# EAGLE design HUD_Display (EAGLE 7.3.0)
CNAME: 7-Segment display; CREVISION: 1; DESIGNER: Mosab Wadea
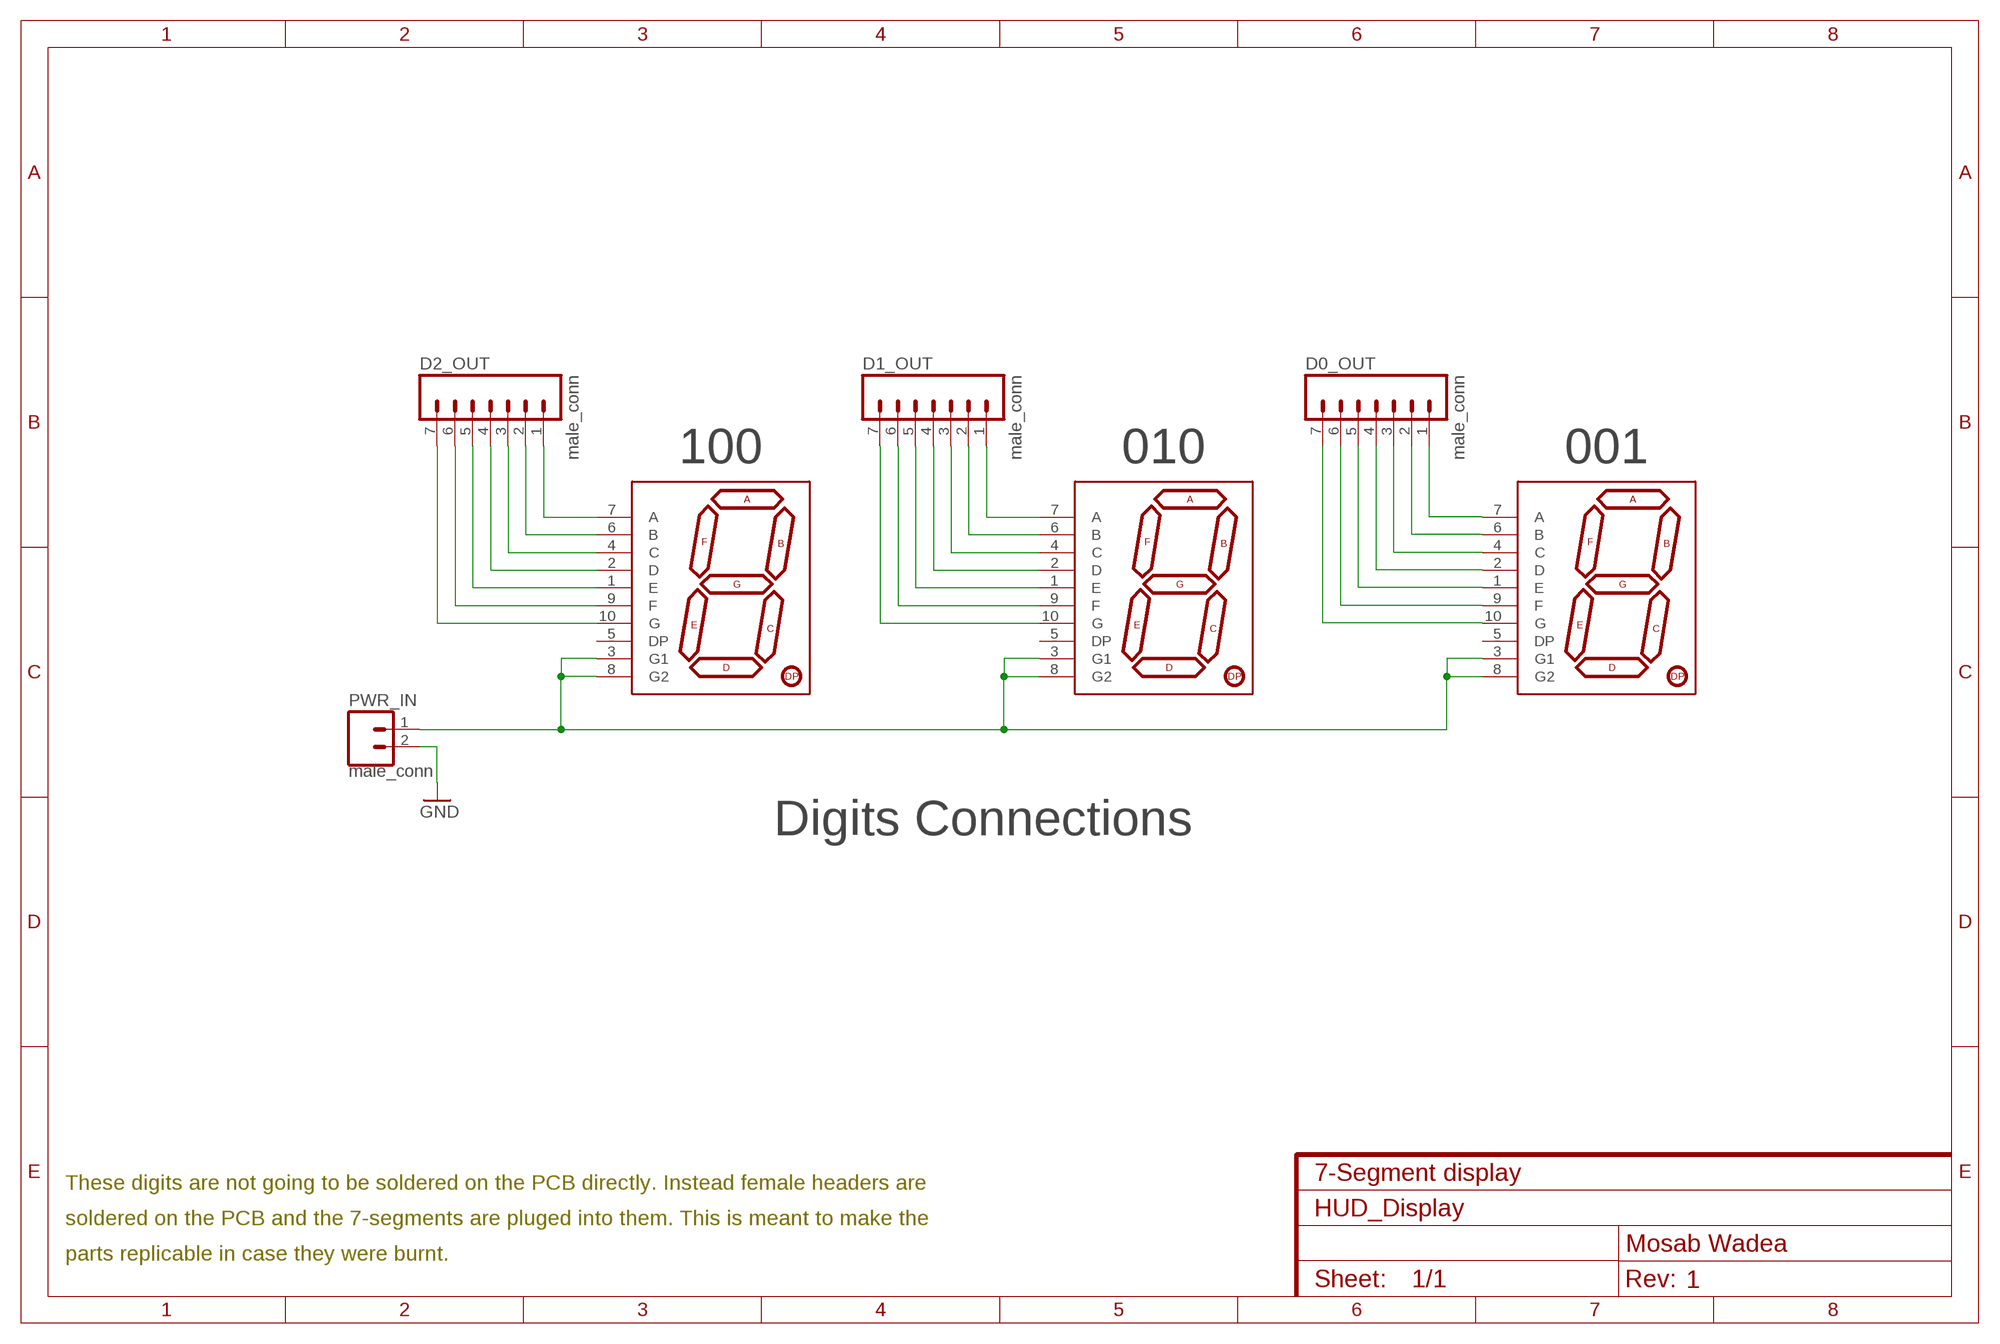
[diagram p0: schematic, sheet 1]

## Parts
D0  7-SEGMENT-DISPLAY-1"-REDEZ  [7-SEGMENT-1"PTH-EZ]
D0_OUT  male_conn  M07  [1X07]
D1  7-SEGMENT-DISPLAY-1"-REDEZ  [7-SEGMENT-1"PTH-EZ]
D1_OUT  male_conn  M07  [1X07]
D2  7-SEGMENT-DISPLAY-1"-REDEZ  [7-SEGMENT-1"PTH-EZ]
D2_OUT  male_conn  M07  [1X07]
PWR_IN  male_conn  M02PTH  [1X02]

## Nets
D1_OUT: D1.9(F) D1_OUT.6
DO_OUT: D2.10(G) D2_OUT.7
GND: PWR_IN.2
N$1: D2.7(A) D2_OUT.1
N$2: D2.6(B) D2_OUT.2
N$3: D2.4(C) D2_OUT.3
N$4: D2.2(D) D2_OUT.4
N$5: D2.1(E) D2_OUT.5
N$6: D2.9(F) D2_OUT.6
N$8: D1.7(A) D1_OUT.1
N$9: D1.6(B) D1_OUT.2
N$10: D1.4(C) D1_OUT.3
N$11: D1.2(D) D1_OUT.4
N$12: D1.1(E) D1_OUT.5
N$14: D1.10(G) D1_OUT.7
N$15: D0.7(A) D0_OUT.1
N$16: D0.6(B) D0_OUT.2
N$17: D0.4(C) D0_OUT.3
N$18: D0.2(D) D0_OUT.4
N$19: D0.1(E) D0_OUT.5
N$20: D0.9(F) D0_OUT.6
N$21: D0.10(G) D0_OUT.7
VCC: D0.3(G1) D0.8(G2) D1.3(G1) D1.8(G2) D2.3(G1) D2.8(G2) PWR_IN.1
Unconnected: D0.5(DP) D1.5(DP) D2.5(DP)

## Notes on the sheet
- 100 | 010 | 001
- Digits Connections
- These digits are not going to be soldered on the PCB directly. Instead female headers are
- soldered on the PCB and the 7-segments are pluged into them. This is meant to make the
- parts replicable in case they were burnt.

## Library data of the parts
D0 D1 D2 = SparkFun-Displays:7-SEGMENT-DISPLAY-1"-RED: 7-Segment Display 1" Red (COM-08546) EZ is for kits. Pads are only exposed on the bottom side to help prevent soldering in upside down.
D0_OUT D1_OUT D2_OUT = SparkFun-Connectors:M07: Header 7 Standard 7-pin 0.1" header. Use with straight break away headers (SKU : PRT-00116), right angle break away headers (PRT-00553), swiss pins (PRT-00743), machine pins (PRT-00117), and female headers (PRT-00115). NOTES ON THE VARIANTS LOCK and LOCK_LONGPADS... This footprint was designed to help hold the alignment of a through-hole component (i.e. 7-pin header) while soldering it into place. You may notice that each hole has been shifted either up or down by 0.005 of an inch from it's more standard position (which is usually a perfectly straight line). This slight alteration caused the pins (the squares in the middle) to touch the edges of the holes. Because they are alternating, it causes a "brace" to hold the header in place. 0.005 has proven to be the perfect amount of "off-center" position when using our standard breakaway headers. Although looks a little odd when you look at the bare footprint, once you have a header in there, the alteration is very hard to notice. Also, if you push a header all the way into place, it is covered up entirely on the bottom side. This idea of altering the position of holes to aid alignment will be further integrated into the Sparkfun Library for other footprints. It can help hold any component with 3 or more connection pins.
PWR_IN = SparkFun-Connectors:M02: Standard 2-pin 0.1" header. Use with - straight break away headers ( PRT-00116) - right angle break away headers (PRT-00553) - swiss pins (PRT-00743) - machine pins (PRT-00117) - female headers (PRT-00115) Molex polarized connector foot print use with: PRT-08233 with associated crimp pins and housings. 2.54_SCREWTERM for use with PRT-10571. 3.5mm Screw Terminal footprints for PRT-08084 5mm Screw Terminal footprints for use with PRT-08432

## Board
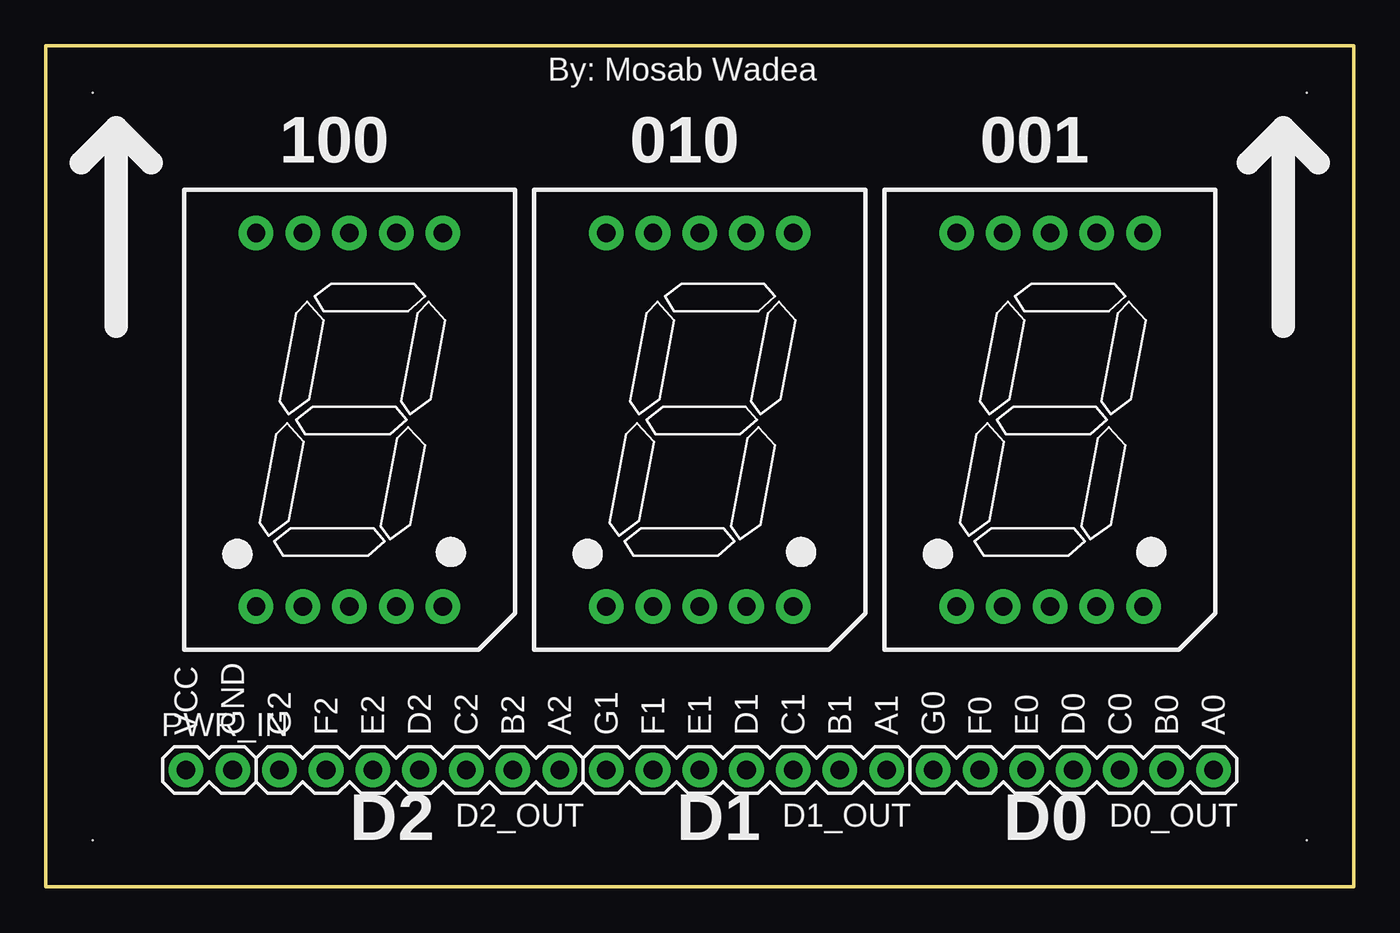
[diagram p1: board, top side]
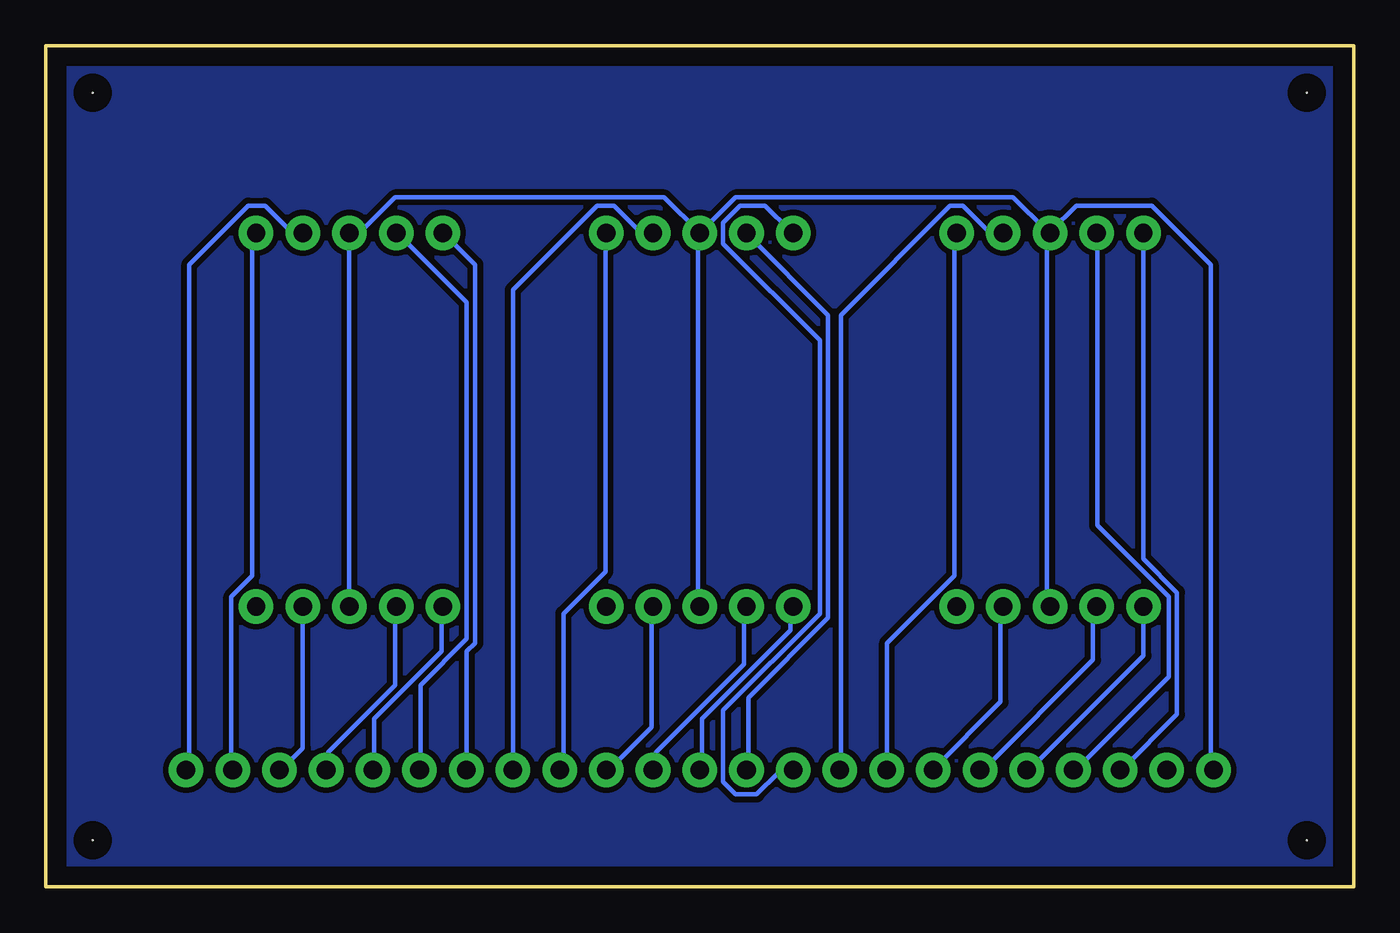
[diagram p2: board, bottom side, seen from below]

Size 71.12 x 45.72 mm. Coordinates in mm from the lower left corner, seen from the top.
Outline: 0,0 0,45.72 71.12,45.72 71.12,0 0,0
Copper layers (1*16): Top 0.035mm / dielectric 1.5mm / Bottom 0.035mm
Design rules "default": minimum track width 10mil, minimum drill 24mil, track to track 8mil, track to pad 8mil, pad to pad 8mil, via to via 8mil, smd to smd 8mil, copper to edge 40mil, drill to drill 8mil, minimum pad ring 10mil, minimum via ring 8mil, stop-mask expansion 4mil, vias tented up to drill 0mil, thermal gap 10mil
Holes 0.02 mm at 2.54,43.18 68.58,43.18 68.58,2.54 2.54,2.54

### Footprints (pad centres in the part's own frame; a part is rotated, then mirrored left to right if it is on the bottom)
7-SEGMENT-1"PTH-EZ = drill 1 pad 1.88: 1 -5.08,-10.16; 2 -2.54,-10.16; 3 0,-10.16; 4 2.54,-10.16; 5 5.08,-10.16; 6 5.08,10.16; 7 2.54,10.16; 8 0,10.16; 9 -2.54,10.16; 10 -5.08,10.16
1X07 = drill 1.016 pad 1.88: 1 0,0; 2 2.54,0; 3 5.08,0; 4 7.62,0; 5 10.16,0; 6 12.7,0; 7 15.24,0
1X02 = drill 1.016 pad 1.88: 1 0,0; 2 2.54,0

### Placement (x,y rotation side)
D0  54.61,25.4 0 top
D0_OUT  63.5,6.35 180 top
D1  35.56,25.4 0 top
D1_OUT  45.72,6.35 180 top
D2  16.51,25.4 0 top
D2_OUT  27.94,6.35 180 top
PWR_IN  7.62,6.35 0 top

### Tracks (layer width: path | path; a pad name or v marks a point on that pad's centre or on a via)
D1_OUT
  Bottom 0.254: D1_OUT.6 32.92,6.4 32.92,10.29 28.57,14.63 28.57,31.09 32.92,35.43 D1.9
DO_OUT
  Bottom 0.254: D2.10 11.43,17.83 9.6,16 9.6,9.37 12.57,6.4 D2_OUT.7
N$1
  Bottom 0.254: D2.7 19.2,35.66 19.89,35.66 21.26,37.03 21.95,37.03 27.89,31.09 27.89,6.4 D2_OUT.1
N$2
  Bottom 0.254: D2.6 21.72,35.43 21.72,16.92 25.38,13.26 25.38,6.4 D2_OUT.2
N$3
  Bottom 0.254: D2.4 19.2,15.09 19.2,10.06 22.86,6.4 D2_OUT.3
N$4
  Bottom 0.254: D2.2 14.17,15.09 14.17,12.34 20.12,6.4 D2_OUT.4
N$5
  Bottom 0.254: D2.1 11.43,12.57 17.6,6.4 D2_OUT.5
N$6
  Bottom 0.254: D2.9 13.95,35.43 13.95,19.66 10.06,15.77 10.06,11.43 15.09,6.4 D2_OUT.6
N$7
  pour Bottom (isolate 0.305): 71.12,0 0,0 0,45.72 71.12,45.72
N$8
  Bottom 0.254: D1_OUT.1 45.72,32.46 41.15,37.03 40.23,37.03 38.86,35.66 38.18,35.66 D1.7
N$9
  Bottom 0.254: D1.6 40.69,35.43 40.69,17.14 42.98,14.86 42.98,6.4 D1_OUT.2
N$10
  Bottom 0.254: D1.4 38.18,15.09 38.18,8.69 40.46,6.4 D1_OUT.3
N$11
  Bottom 0.254: D1.2 33.15,15.09 33.15,12.12 37.95,7.32 37.95,6.4 D1_OUT.4
N$12
  Bottom 0.254: D1.1 30.63,15.09 30.63,13.95 35.43,9.14 35.43,6.4 D1_OUT.5
N$14
  Bottom 0.254: D1_OUT.7 30.63,6.17 31.32,6.17 32.46,5.03 33.6,5.03 34.29,5.71 34.29,9.6 29.03,14.86 29.03,29.72 34.29,34.98 34.29,36.12 33.38,37.03 32,37.03 30.63,35.66 D1.10
N$15
  Bottom 0.254: D0.7 57.15,35.66 57.84,35.66 59.21,37.03 60.12,37.03 63.32,33.83 63.32,6.4 D0_OUT.1
N$16
  Bottom 0.254: D0.6 59.89,35.43 59.89,16.92 61.04,15.77 61.04,6.4 D0_OUT.2
N$17
  Bottom 0.254: D0.4 57.15,7.54 58.29,6.4 D0_OUT.3
N$18
  Bottom 0.254: D0.2 52.12,15.09 52.12,10.97 55.78,7.32 55.78,6.4 D0_OUT.4
N$19
  Bottom 0.254: D0.1 49.61,15.09 49.61,12.8 53.26,9.14 53.26,6.4 D0_OUT.5
N$20
  Bottom 0.254: D0_OUT.6 50.75,6.4 50.75,10.97 48.23,13.49 48.23,31.77 51.89,35.43 D0.9
N$21
  Bottom 0.254: D0_OUT.7 48.23,6.4 48.23,12.8 47.78,13.26 47.78,33.83 49.38,35.43 D0.10
VCC
  Bottom 0.254: D0.3 54.63,15.32 54.63,35.43 D0.8 54.41,35.66 53.95,35.66 52.12,37.49 37.49,37.49 D1.8 | D1.3 35.66,15.32 35.66,35.43 D1.8 | PWR_IN.1 7.77,6.4 7.77,33.83 10.97,37.03 15.09,37.03 16.46,35.66 D2.8 | D2.3 16.69,15.32 16.69,35.43 D2.8 | D1.8 35.43,35.66 33.6,37.49 18.52,37.49 16.69,35.66 D2.8

### Text on the board
tPlace: By: Mosab Wadea | 100 | 010 | 001 | VCC | GND | G2 | F2 | E2 | D2 | C2 | B2 | A2 | G1 | F1 | E1 | D1 | C1 | B1 | A1 | G0 | F0 | E0 | D0 | C0 | B0 | A0 | D2 | D1 | D0